# Altium schematic sheet SIM Socket.SchDoc: SIM Tray
size 292 x 193 mm; SheetNumber: 7; SheetTotal: 8
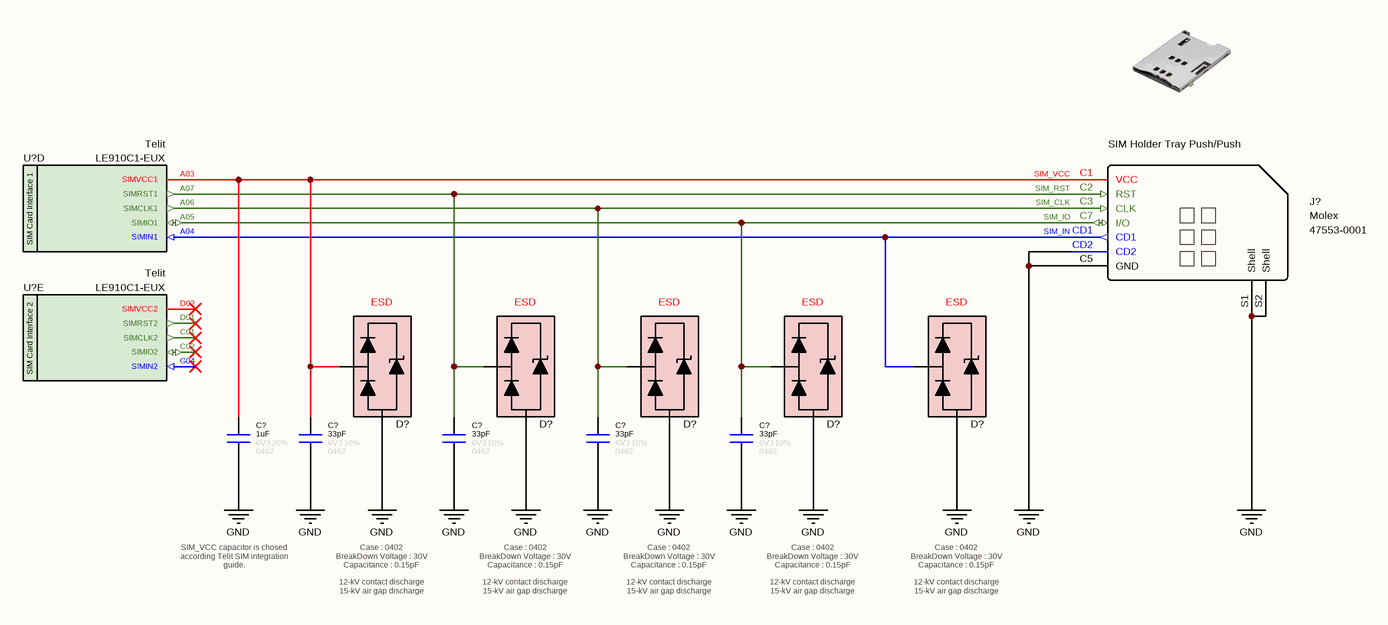
[diagram p0: SIM Socket.SchDoc]

## Parts
(Parts that share a designator on the sheet are numbered #1, #2 ... from top to bottom, then left to right.)
C?#1  value 1uF  Tolerance: 20%  Case: 0402  Voltage: 6V3  [CAPACITOR_0402]  (hidden comment: Capacitor - 1uF [0402] (Ceramic))
C?#2  value 33pF  Tolerance: 10%  Case: 0402  Voltage: 6V3  [CAPACITOR_0402]  (hidden comment: Capacitor - 33pF [0402] (Ceramic))
C?#3  value 33pF  Tolerance: 10%  Case: 0402  Voltage: 6V3  [CAPACITOR_0402]  (hidden comment: Capacitor - 33pF [0402] (Ceramic))
C?#4  value 33pF  Tolerance: 10%  Case: 0402  Voltage: 6V3  [CAPACITOR_0402]  (hidden comment: Capacitor - 33pF [0402] (Ceramic))
C?#5  value 33pF  Tolerance: 10%  Case: 0402  Voltage: 6V3  [CAPACITOR_0402]  (hidden comment: Capacitor - 33pF [0402] (Ceramic))
D?#1  0402ESDA-MLP1  [ESD_0402]  (value not drawn)
D?#2  0402ESDA-MLP1  [ESD_0402]  (value not drawn)
D?#3  0402ESDA-MLP1  [ESD_0402]  (value not drawn)
D?#4  0402ESDA-MLP1  [ESD_0402]  (value not drawn)
D?#5  0402ESDA-MLP1  [ESD_0402]  (value not drawn)
J?  Card Type: SIM Holder Tray Push/Push  Manufacturer Name: Molex  Manufacturer Part Number: 47553-0001  [CONNECTOR - SIM Card]  (hidden comment: SIM Holder Tray)
U?#1  Manufacturer Part Number: LE910C1-EUX  Manufacturer Name: Telit  [LE910 GSM Modem]  (hidden comment: LE910C1-EUX LTE GSM Module)  (part D of 19)
U?#2  Manufacturer Part Number: LE910C1-EUX  Manufacturer Name: Telit  [LE910 GSM Modem]  (hidden comment: LE910C1-EUX LTE GSM Module)  (part E of 19)

## Nets
GND: C?#1.1 C?#2.1 C?#3.1 C?#4.1 C?#5.1 D?#1.2(GND) D?#2.2(GND) D?#3.2(GND) D?#4.2(GND) D?#5.2(GND) J?.C5(GND) J?.CD2 J?.S1(Shell) J?.S2(Shell)
SIM_CLK: C?#4.2 D?#3.1(I/O) J?.C3(CLK) U?#1.A06(SIMCLK1)
SIM_IN: D?#5.1(I/O) J?.CD1 U?#1.A04(SIMIN1)
SIM_IO: C?#5.2 D?#4.1(I/O) J?.C7(I/O) U?#1.A05(SIMIO1)
SIM_RST: C?#3.2 D?#2.1(I/O) J?.C2(RST) U?#1.A07(SIMRST1)
SIM_VCC: C?#1.2 C?#2.2 D?#1.1(I/O) J?.C1(VCC) U?#1.A03(SIMVCC1)

Not connected (* = marked no-connect by the designer): U?#2 C01(SIMCLK2)* C02(SIMIO2)* D01(SIMRST2)* D02(SIMVCC2)* G04(SIMIN2)*

## Notes on the sheet
- SIM_VCC capacitor is chosed according Telit SIM integration guide.
- Case : 0402
  BreakDown Voltage : 30V
  Capacitance : 0.15pF
  12-kV contact discharge
  15-kV air gap discharge
- © 2026 All rights reserved.
  This document may not, in whole or in part, be copied, photocopied, reproduced, translated or converted to any electronic or machine readable from without prior written permission of Mehmet Günce Akkoyun.
  Engineer contact : akkoyun@me.com
- Property of
- Engineer :
- Date :
- Size :
- A4
- Time :
- Project :
- Page :
- /
- Customer :
- Product ID :
- Module ID :
- Version :
- File :
- Revision :
- (in symbol Diode - TPD1E05U06DPYR) ESD
- (in symbol IC - LE910C1-EUX, part D) SIM Card Interface 1
- (in symbol IC - LE910C1-EUX, part E) SIM Card Interface 2

## Library data of the parts
C?#1 = Capacitor - 1uF [0402-6V3]: Multilayer Ceramic Capacitors - SMD - 6.3V 1uF X5R 0402 20%; Manufacturer Part Number: GRM153R60J105ME95D; Manufacturer Name: Murata
C?#2-C?#5 = Capacitor - 33pF [0402-6V3]: Manufacturer Name: Kemet; Manufacturer Part Number: C0402C330J9RACAUTO; ComponentLink1Description: DataSheet; ComponentLink1URL: https://api.kemet.com/component-edge/download/datasheet/C0402C330J9RACAUTO.pdf; ComponentLink2Description: Mouser; ComponentLink2URL: https://www.mouser.com/Search/Refine.aspx?Keyword=80-C0402C330J9RAUTO
D?#1-D?#5 = Diode - TPD1E05U06DPYR: SUPPRESSOR ESD 30VDC 0402 HFREE; Manufacturer Name: Eaton; Breakdown Voltage: 30V; Capacitance: 0.15pF; Manufacturer Part Number: 0402ESDA-MLP1; Case: 0402
J? = Connector - Sim Holder: Memory Card Connectors ASSY 1.90 SIM CARD R IM CARD READER CONN.
U?#1 U?#2 = IC - LE910C1-EUX: Telit LE910C1-EUX LTE/2G GSM Module; Case: BGA